# EAGLE design triangular_drawdio (EAGLE 6.5.0)
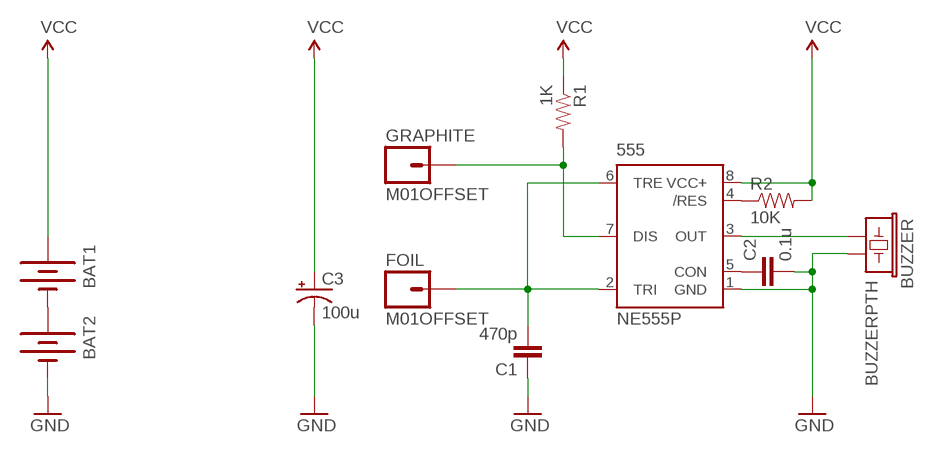
[diagram p0: schematic, sheet 1]

## Parts
555  NE555P  [DIL-08]
BAT1  BATTERY20PTH  [BATTCOM_20MM_PTH]
BAT2  BATTERY20PTH  [BATTCOM_20MM_PTH]
BUZZER  BUZZERPTH  [BUZZER-12MM]
C1  470p  CAPPTH2  [CAP-PTH-SMALL2]
C2  0.1u  CAPPTH2  [CAP-PTH-SMALL2]
C3  100u  CAP_POLPTH2  [CPOL-RADIAL-10UF-25V]
FOIL  M01OFFSET  [1X01_OFFSET]
GRAPHITE  M01OFFSET  [1X01_OFFSET]
R1  1K  RESISTORPTH-1/4W  [AXIAL-0.4]
R2  10K  RESISTORPTH-1/4W  [AXIAL-0.4]

## Nets
GND: 555.1(GND) BAT2.2(-) BUZZER.- C1.1 C2.2 C3.2(-)
N$2: 555.5(CON) C2.1
N$3: 555.3(OUT) BUZZER.+
N$4: 555.4(/RES) R2.P$1
N$5: 555.7(DIS) GRAPHITE.1 R1.P$2
N$6: 555.2(TRI) 555.6(TRE) C1.2 FOIL.1
V_ALT: BAT1.2(-) BAT2.1(+)
VCC: 555.8(VCC+) BAT1.1(+) C3.1(+) R1.P$1 R2.P$2

## Library data of the parts
555 = SparkFun-AnalogIC:NE555: General purpose bipolar Timer; MF: Arrow Electronics; MPN: NE555N; OC_FARNELL: 1467742; OC_NEWARK: 89K1486
BAT1 BAT2 = SparkFun-Electromechanical:BATTERY: Battery Holders Various common sizes : AA, AAA, 20mm coin cell and 12mm coin cell. 20MM_4LEGS, BATT-10373
BUZZER = SparkFun-Electromechanical:BUZZER: Buzzer 12mm Spark Fun Electronics SKU : Comp-Buzzer
C1 C2 = SparkFun-Passives:CAP: Capacitor Standard 0603 ceramic capacitor, and 0.1" leaded capacitor.
C3 = SparkFun-Capacitors:CAP_POL: Capacitor Polarized These are standard SMD and PTH capacitors. Normally 10uF, 47uF, and 100uF in electrolytic and tantalum varieties. Always verify the external diameter of the through hole cap, it varies with capacity, voltage, and manufacturer. The EIA devices should be standard.
FOIL GRAPHITE = SparkFun-Connectors:M01: Header 1 Standard 1-pin 0.1" header. Use with straight break away headers (SKU : PRT-00116), right angle break away headers (PRT-00553), swiss pins (PRT-00743), machine pins (PRT-00117), and female headers (PRT-00115).
R1 R2 = SparkFun-Resistors:RESISTOR: Resistor Basic schematic elements and footprints for 0603, 1206, and PTH resistors.

## Board
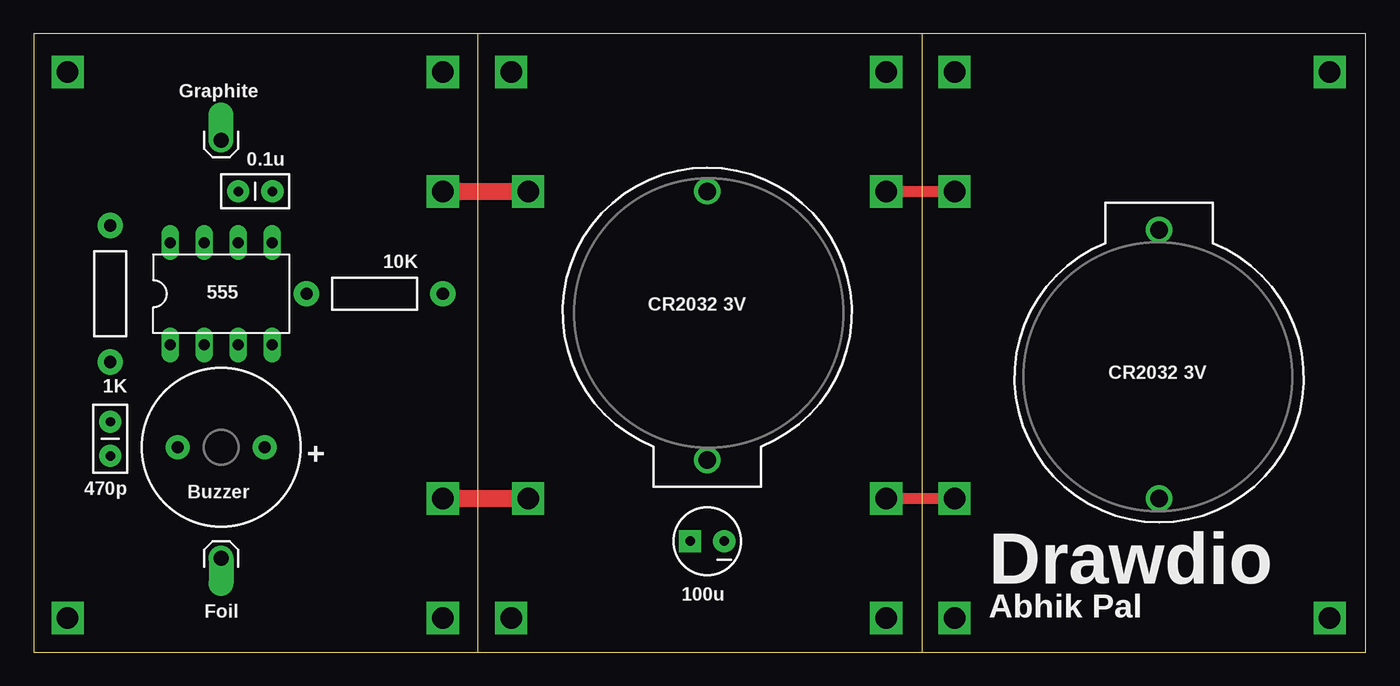
[diagram p1: board, top side]
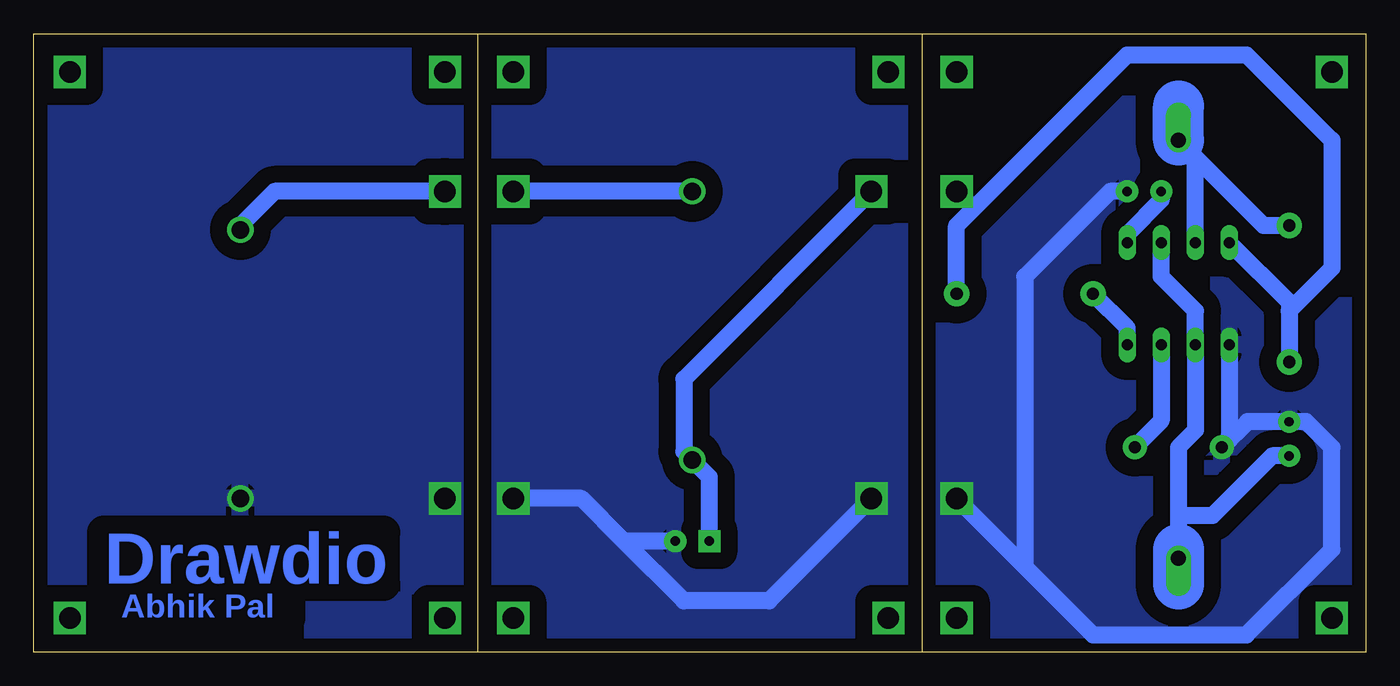
[diagram p2: board, bottom side, seen from below]

Size 99.22 x 46.04 mm. Coordinates in mm from the lower left corner, seen from the top.
Outline: 33.07,0 0,0 0,46.04 33.07,46.04
Outline: 33.07,0 66.15,0
Outline: 66.15,0 99.22,0 99.22,46.04 66.15,46.04
Outline: 66.15,46.04 33.07,46.04
Outline: 33.07,46.04 33.07,0
Outline: 66.15,46.04 66.15,0
Copper layers (1*16): Top 0.035mm / dielectric 1.5mm / Bottom 0.035mm
Design rules "default *": minimum track width 10mil, minimum drill 24mil, track to track 50mil, track to pad 50mil, pad to pad 50mil, via to via 50mil, smd to smd 50mil, copper to edge 40mil, drill to drill 8mil, minimum pad ring 10mil, minimum via ring 8mil, stop-mask expansion 4mil, vias tented up to drill 0mil, thermal gap 10mil

### Footprints (pad centres in the part's own frame; a part is rotated, then mirrored left to right if it is on the bottom)
DIL-08 = drill 0.813 long: 1 -3.81,-3.81; 2 -1.27,-3.81; 3 1.27,-3.81; 4 3.81,-3.81; 5 3.81,3.81; 6 1.27,3.81; 7 -1.27,3.81; 8 -3.81,3.81
BATTCOM_20MM_PTH = drill 1.3: 1 20,0; 2 0,0
BUZZER-12MM = drill 0.9 pad 1.778: + 3.25,0; - -3.25,0
CAP-PTH-SMALL2 = drill 0.7 pad 1.651: 1 0,0; 2 2.54,0
CPOL-RADIAL-10UF-25V = drill 0.7 pad 1.651 square: 1 1.27,0 | drill 0.7 pad 1.651: 2 -1.27,0
1X01_OFFSET = drill 1.118 pad 1.88 offset: 1 0,0
AXIAL-0.4 = drill 0.9 pad 1.88: P$1 -5.08,0; P$2 5.08,0

### Placement (x,y rotation side)
555  13.97,26.67 0 top
BAT1  50.16,34.29 270 top
BAT2  83.82,11.43 90 top
BUZZER  13.97,15.24 0 top
C1  5.71,17.14 270 top
C2  15.24,34.29 0 top
C3  50.16,8.26 180 top
FOIL  13.97,6.99 180 top
GRAPHITE  13.97,38.1 0 top
R1  5.71,26.67 90 top
R2  25.4,26.67 0 top

### Tracks (layer width: path | path; a pad name or v marks a point on that pad's centre or on a via)
GND  (via drill 1.3, 1.6 pad 1.27)
  Top 0.813: v63.5,11.43 v68.58,11.43
  Top 1.27: v30.48,11.43 v36.83,11.43
  Bottom 1.27: C3.2 55.24,8.26 | 55.24,8.26 58.42,11.43 v63.5,11.43 | 555.1 10.16,15.8 BUZZER.- 8.81,17.14 C1.1 4.45,17.14 2.54,15.24 2.54,7.62 8.89,1.27 20.32,1.27 25.4,6.35 | 25.4,6.35 v30.48,11.43 | v36.83,11.43 44.45,3.81 50.8,3.81 55.24,8.26 | C2.2 19.05,34.29 25.4,27.94 25.4,6.35
  pour Bottom: 0,45.72 33.02,45.72 33.02,0 0,0
  pour Bottom: 33.02,45.72 66.04,45.72 66.04,0 33.02,0
  pour Bottom: 66.04,45.72 99.06,45.72 99.06,0 66.04,0
N$2
  Bottom 1.27: C2.1 15.24,33.66 17.78,31.11 555.5
N$3
  Bottom 1.27: 555.3 15.24,17.22 BUZZER.+
N$4
  Bottom 1.27: 555.4 17.78,24.13 R2.P$1
N$5
  Bottom 1.27: 555.7 12.7,36.83 | 12.7,36.83 GRAPHITE.1 | R1.P$2 7.62,31.75 12.7,36.83
  Bottom 3.81: GRAPHITE.1 13.97,40.64
N$6
  Bottom 1.27: 555.6 15.24,27.94 12.7,25.4 555.2 12.7,16.51 13.97,15.24 13.97,10.16 | 13.97,10.16 13.97,7.62 FOIL.1 | C1.2 6.99,14.61 11.43,10.16 13.97,10.16
  Bottom 3.81: 13.97,7.62 13.97,5.08
N$7  (via drill 1.6 pad 1.27)
  other vias: 2.54,43.18
N$8  (via drill 1.6 pad 1.27)
  other vias: 2.54,2.54
N$9  (via drill 1.6 pad 1.27)
  other vias: 30.48,2.54
N$10  (via drill 1.6 pad 1.27)
  other vias: 35.56,2.54
N$11  (via drill 1.6 pad 1.27)
  other vias: 35.56,43.18
N$12  (via drill 1.6 pad 1.27)
  other vias: 30.48,43.18
N$13  (via drill 1.6 pad 1.27)
  other vias: 63.5,43.18
N$14  (via drill 1.6 pad 1.27)
  other vias: 68.58,43.18
N$15  (via drill 1.6 pad 1.27)
  other vias: 63.5,2.54
N$16  (via drill 1.6 pad 1.27)
  other vias: 68.58,2.54
N$17  (via drill 1.6 pad 1.27)
  other vias: 96.52,2.54
N$18  (via drill 1.6 pad 1.27)
  other vias: 96.52,43.18
V_ALT  (via drill 1.6 pad 1.27, 1.6 pad 1.42)
  Top 0.813: v63.5,34.29 v68.58,34.29
  Bottom 1.27: v68.58,34.29 81.28,34.29 83.82,31.75 BAT2.1 | BAT1.2 v63.5,34.29
VCC  (via drill 1.3, 1.6, 1.6 pad 1.27)
  Top 1.27: v30.48,34.29 v36.83,34.29
  Bottom 1.27: C3.1 48.9,13.02 BAT1.1 50.8,14.93 50.8,20.32 v36.83,34.29 | 555.8 5.71,26.04 5.71,25.4 | 5.71,25.4 R1.P$1 | 29.21,33.02 17.78,44.45 8.89,44.45 2.54,38.1 2.54,28.57 5.71,25.4 | R2.P$2 30.48,31.75 29.21,33.02 | 29.21,33.02 v30.48,34.29

### Text on the board
Bottom: Drawdio | Abhik Pal
tNames: Graphite | 0.1u | 10K | 555 | CR2032 3V | 1K | CR2032 3V | + | 470p | Buzzer | Drawdio | 100u | Foil | Abhik Pal